# Altium schematic sheet Power.SchDoc
size A4
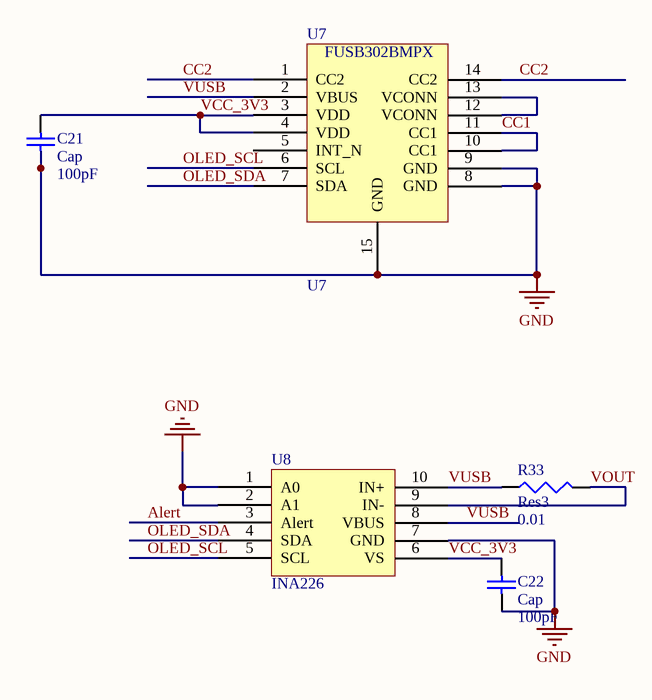
[diagram p0: Power.SchDoc]

## Parts
C21  Cap  value 100pF  [0402]
C22  Cap  value 100pF  [0402]
R33  Res3  value 0.01  [C2512]
U7  U7  [MCL14]
U8  INA226  [SSOP10]

## Nets
GND: C21.1 C22.1 U7.8(GND) U7.9(GND) U7.15(GND) U8.1(A0) U8.2(A1) U8.7(GND)
Alert: U8.3(Alert)
CC1: U7.10(CC1) U7.11(CC1)
CC2: U7.1(CC2) U7.14(CC2)
OLED_SCL: U7.6(SCL) U8.5(SCL)
OLED_SDA: U7.7(SDA) U8.4(SDA)
VCC_3V3: C21.2 C22.2 U7.3(VDD) U7.4(VDD) U8.6(VS)
VOUT: R33.2 U8.9(IN-)
VUSB: R33.1 U7.2(VBUS) U8.8(VBUS) U8.10(IN+)
NetU7_12: U7.12(VCONN) U7.13(VCONN)

Not connected (* = marked no-connect by the designer): U7 5(INT_N)

## Notes on the sheet
- (in symbol FUSB302B) FUSB302BMPX

## Library data of the parts
C21 C22 = Cap: Capacitor; Published: 8-Jun-2000; LatestRevisionDate: 17-Jul-2002; LatestRevisionNote: Re-released for DXP Platform.; PackageReference: RAD-0.3; Publisher: Altium Limited; PackageDescription: Radial Cap, Thru-Hole; 2 Leads; 0.3 in Pin Spacing
R33 = Res3: Resistor; Published: 8-Jun-2000; LatestRevisionDate: 29-May-2009; LatestRevisionNote: IPC-7351 Footprint Added.; PackageReference: J1-0603; Publisher: Altium Limited; PackageDescription: Chip Resistor
U7 = FUSB302B